# Altium project DIOT_tester.PrjPCB (part 1 of 3)
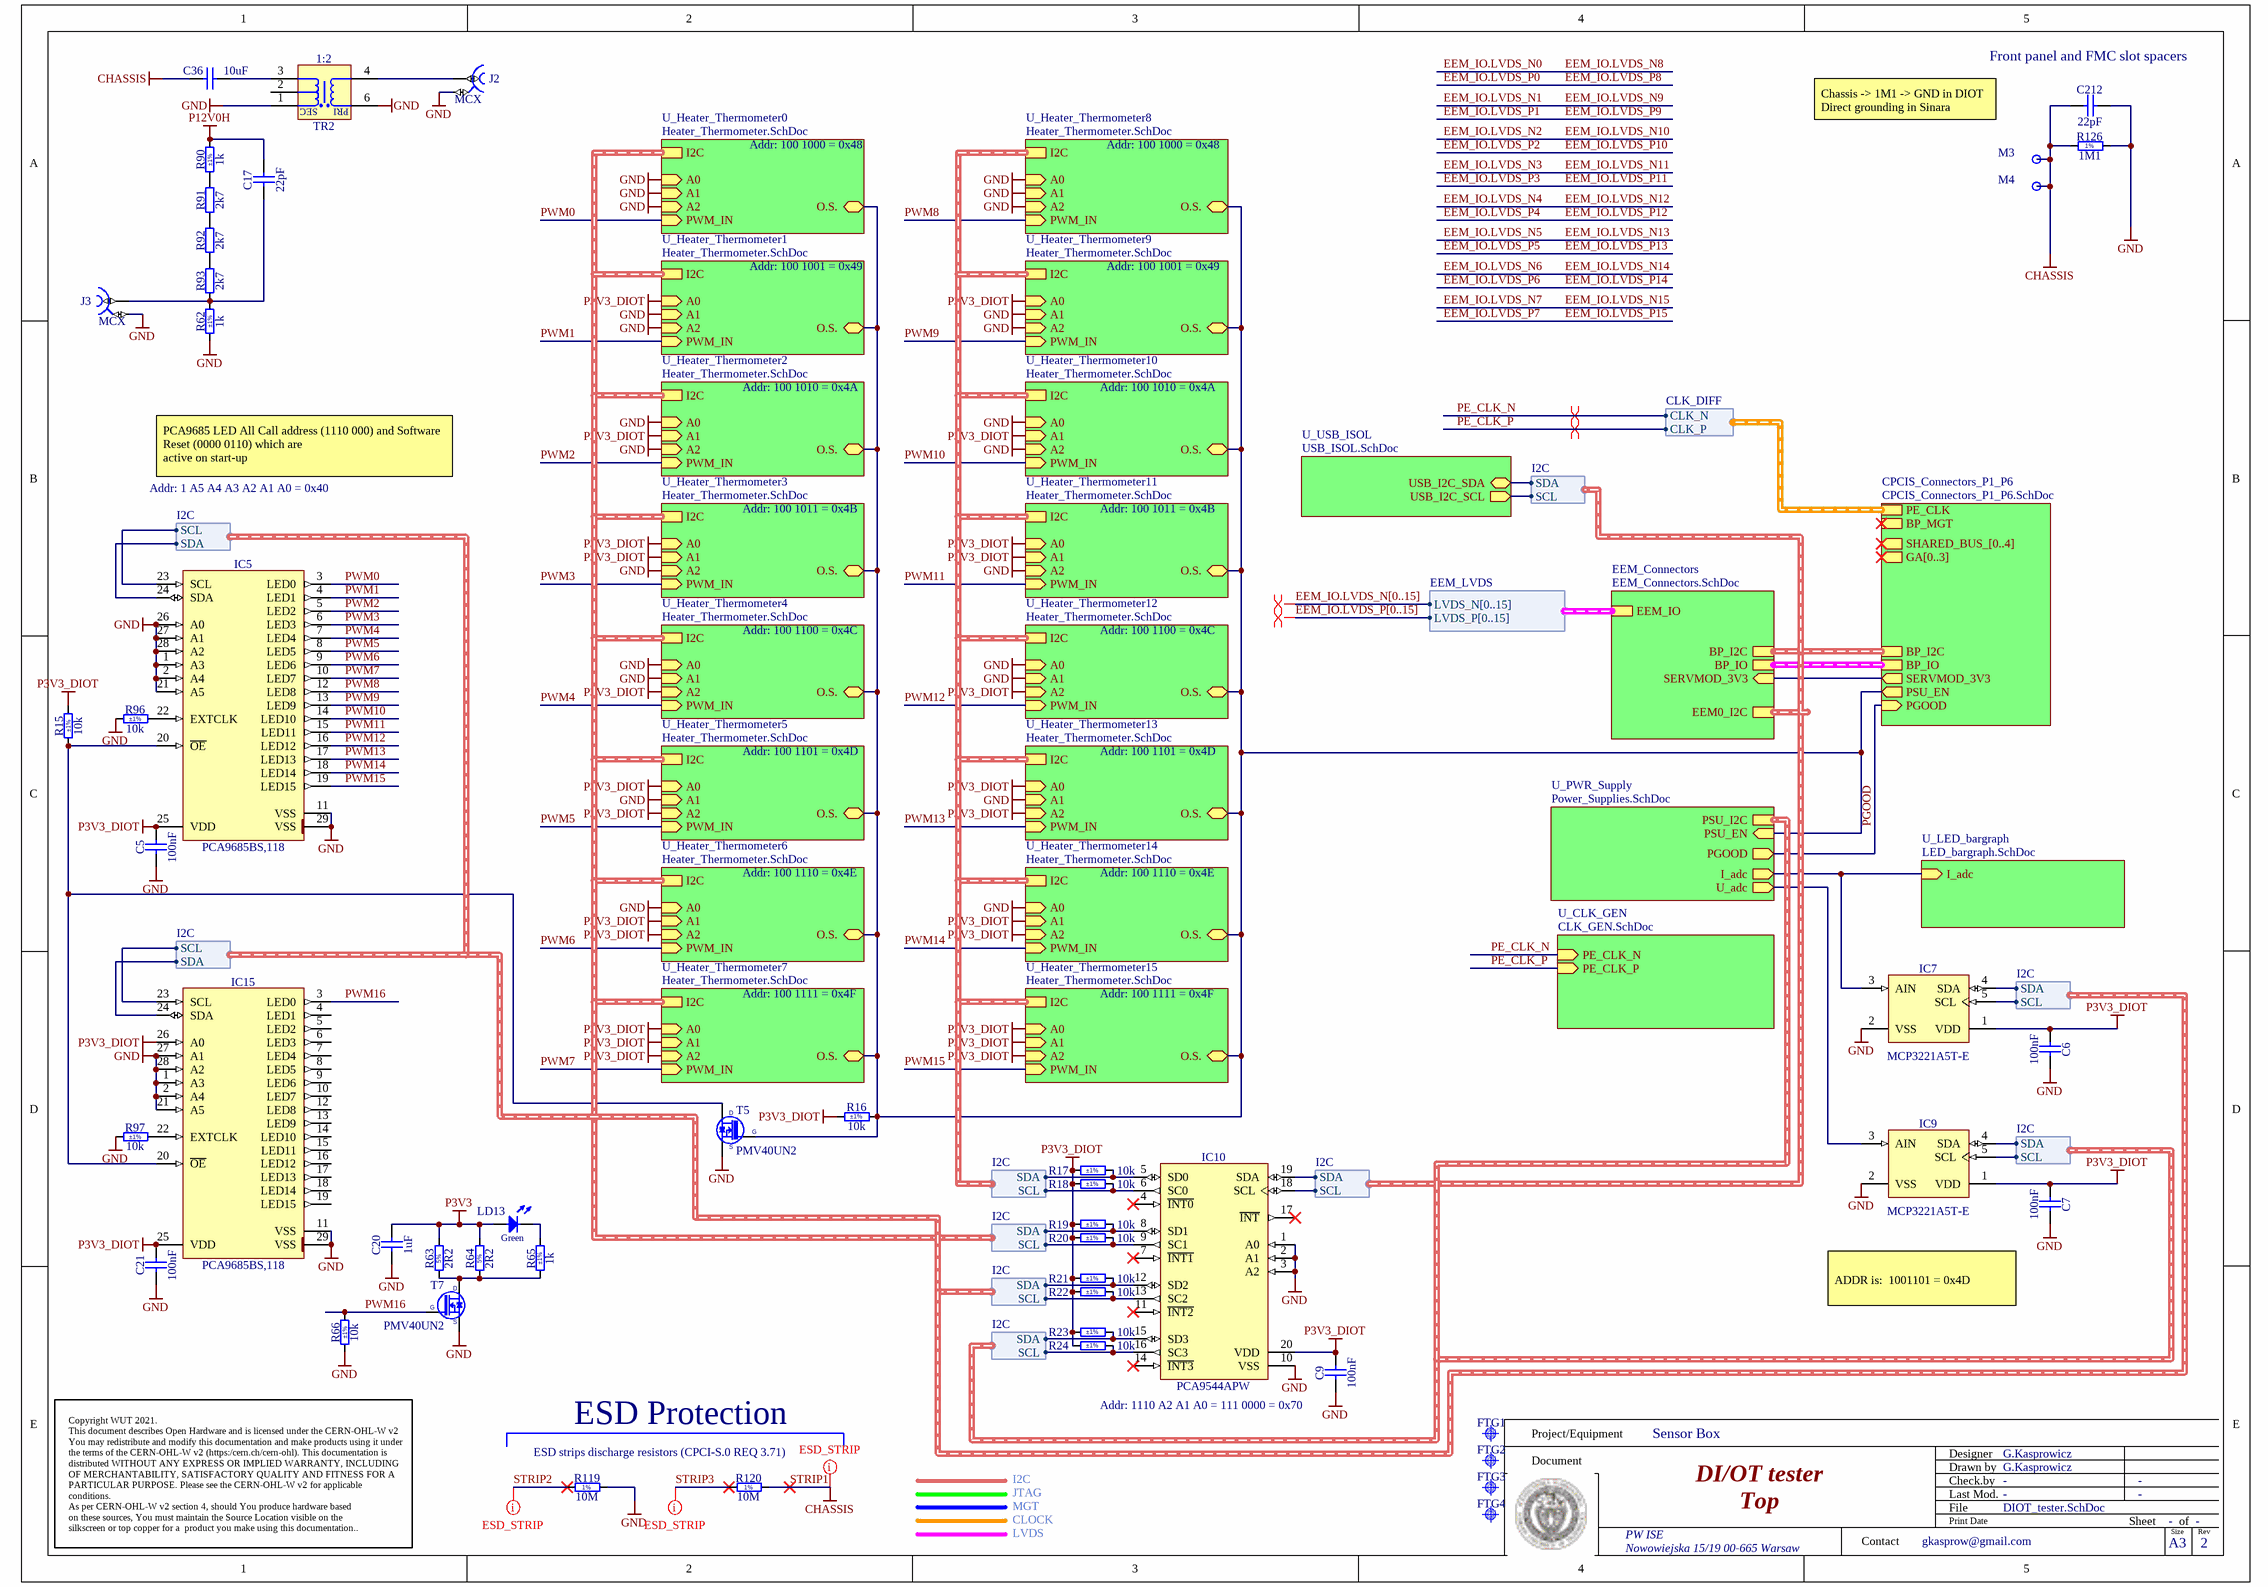
[diagram p0: DIOT_tester.SchDoc]
Address1: Warsaw University of Technology; Address2: Nowowiejska 15/19 00-665 Warsaw; Address3: Grzegorz.Kasprowicz@pw.edu.pl; CheckedBy: -; CheckedDate: -; Designer: Grzegorz Kasprowicz; DivGrp: ISE; DrawnBy: Grzegorz Kasprowicz; P_version: 1.1; Project1: 2CH_PM_Simulator; Projet: ARTIQ/Sinara; SheetTotal: 12; Title: 2CH_PM_Simulator; Version: 1.1
8 sheets, 432 parts. Net scope: hierarchical (ports join the sheet entries above them; power ports are global).
Board files: DIOT_tester.PcbDoc, Panel_DIOT_Tester.PcbDoc
Sheets:
  DIOT_tester.SchDoc
    U_PWR_Supply = Power_Supplies.SchDoc
    CPCIS_Connectors_P1_P6 = CPCIS_Connectors_P1_P6.SchDoc
    EEM_Connectors = EEM_Connectors.SchDoc
    U_CLK_GEN = CLK_GEN.SchDoc
    U_Heater_Thermometer0 = Heater_Thermometer.SchDoc
    U_Heater_Thermometer1 = Heater_Thermometer.SchDoc
    U_Heater_Thermometer2 = Heater_Thermometer.SchDoc
    U_Heater_Thermometer3 = Heater_Thermometer.SchDoc
    U_Heater_Thermometer4 = Heater_Thermometer.SchDoc
    U_Heater_Thermometer5 = Heater_Thermometer.SchDoc
    U_Heater_Thermometer6 = Heater_Thermometer.SchDoc
    U_Heater_Thermometer7 = Heater_Thermometer.SchDoc
    U_Heater_Thermometer8 = Heater_Thermometer.SchDoc
    U_Heater_Thermometer9 = Heater_Thermometer.SchDoc
    U_Heater_Thermometer10 = Heater_Thermometer.SchDoc
    U_Heater_Thermometer11 = Heater_Thermometer.SchDoc
    U_Heater_Thermometer12 = Heater_Thermometer.SchDoc
    U_Heater_Thermometer13 = Heater_Thermometer.SchDoc
    U_Heater_Thermometer14 = Heater_Thermometer.SchDoc
    U_Heater_Thermometer15 = Heater_Thermometer.SchDoc
    U_LED_bargraph = LED_bargraph.SchDoc
    U_USB_ISOL = USB_ISOL.SchDoc

## Sheet DIOT_tester.SchDoc: DI/OT tester
size 420 x 297 mm; EDA_Number: ARTIQ; Projet: ARTIQ/Sinara; Author: G.Kasprowicz; CompanyName: WUT ISE; DrawnBy: G.Kasprowicz; Organization: WUT ISE; Address1: PW ISE; Address2: Nowowiejska 15/19 00-665 Warsaw; Address3: gkasprow@gmail.com; Revision: 2; SheetNumber: -; SheetTotal: -; ModifiedBy: -; CheckedDate: -; Title2: Top; DivGrp: WUT ISE; Designer: G.Kasprowicz; ModifiedDate: -; ProjectName: Sensor Box

### Parts
C5  100nF  [CAPC1005X55N]
C6  100nF  [CAPC1005X55N]
C7  100nF  [CAPC1005X55N]
C9  100nF  [CAPC1005X55N]
C17  22pF  [CAPC1005X55N]
C20  1uF  [CAPC1608X87N]
C21  100nF  [CAPC1005X55N]
C36  10uF  [CAPC2012X95N]
C212  22pF  [CAPC1005X55N]
FTG1  Use only in PCB  [FIDUCIAL_TOP_C100-200]  (value not drawn)
FTG2  Use only in PCB  [FIDUCIAL_TOP_S100-200]  (value not drawn)
FTG3  Use only in PCB  [FIDUCIAL_TOP_S100-200]  (value not drawn)
FTG4  Use only in PCB  [FIDUCIAL_TOP_S100-200]  (value not drawn)
IC5  PCA9685BS,118  [QFN65P600X600X100-29N-S420]
IC7  MCP3221A5T-E  [SOT95P280X145-5N]
IC9  MCP3221A5T-E  [SOT95P280X145-5N]
IC10  PCA9544APW  [SOP65P640X110-20N]
IC15  PCA9685BS,118  [QFN65P600X600X100-29N-S420]
J2  MCX  [AMPHENOL_919-383J-51A]
J3  MCX  [AMPHENOL_919-383J-51A]
LD13  Green  [LED_KINGBRIGHT_KP-1608CGCK]
M3  Plated Hole  [MTG300_600]  (value not drawn)  (no BOM)
M4  Plated Hole  [MTG300_600]  (value not drawn)  (no BOM)
R15  10k  Tolerance: ±1%  [RESC1005X40N]
R16  10k  Tolerance: ±1%  [RESC1005X40N]
R17  10k  Tolerance: ±1%  [RESC1005X40N]
R18  10k  Tolerance: ±1%  [RESC1005X40N]
R19  10k  Tolerance: ±1%  [RESC1005X40N]
R20  10k  Tolerance: ±1%  [RESC1005X40N]
R21  10k  Tolerance: ±1%  [RESC1005X40N]
R22  10k  Tolerance: ±1%  [RESC1005X40N]
R23  10k  Tolerance: ±1%  [RESC1005X40N]
R24  10k  Tolerance: ±1%  [RESC1005X40N]
R62  1k  Tolerance: ±1%  [RESC1608X55N]
R63  2R2  [RESC6432X120N]
R64  2R2  [RESC6432X120N]
R65  1k  Tolerance: ±1%  [RESC1608X55N]
R66  10k  Tolerance: ±1%  [RESC1005X40N]
R90  1k  Tolerance: ±1%  [RESC1608X55N]
R91  2k7  [RESC1608X55N]
R92  2k7  [RESC1608X55N]
R93  2k7  [RESC1608X55N]
R96  10k  Tolerance: ±1%  [RESC1005X40N]
R97  10k  Tolerance: ±1%  [RESC1005X40N]
R119  10M  [RESC2113X55N]
R120  10M  [RESC2113X55N]
R126  1M1  [RESC2012X60N]
T5  PMV40UN2  [SOT95P230X110-3N]
T7  PMV40UN2  [SOT95P230X110-3N]
TR2  1:2  [XFMR_MINI-CIRCUITS_DB714]

### Sub-sheets
CPCIS_Connectors_P1_P6 = CPCIS_Connectors_P1_P6.SchDoc: BP_I2C (harness I2C), SERVMOD_3V3 (out), PSU_EN (out), PE_CLK (harness CLK_DIFF), BP_MGT (harness MGT), GA[0..3] (out), BP_IO (harness EEM_LVDS), SHARED_BUS_[0..4] (out), PGOOD (in)
EEM_Connectors = EEM_Connectors.SchDoc: EEM_IO (harness EEM_LVDS), BP_IO (harness EEM_LVDS), EEM0_I2C (harness I2C), BP_I2C (harness I2C), SERVMOD_3V3 (in)
U_CLK_GEN = CLK_GEN.SchDoc: PE_CLK_N (in), PE_CLK_P (in)
U_Heater_Thermometer0 = Heater_Thermometer.SchDoc: I2C (harness I2C), O.S. (bidir), A0 (in), A1 (in), A2 (in), PWM_IN (in)
U_Heater_Thermometer1 = Heater_Thermometer.SchDoc: I2C (harness I2C), O.S. (bidir), A0 (in), A1 (in), A2 (in), PWM_IN (in)
U_Heater_Thermometer2 = Heater_Thermometer.SchDoc: I2C (harness I2C), O.S. (bidir), A0 (in), A1 (in), A2 (in), PWM_IN (in)
U_Heater_Thermometer3 = Heater_Thermometer.SchDoc: I2C (harness I2C), O.S. (bidir), A0 (in), A1 (in), A2 (in), PWM_IN (in)
U_Heater_Thermometer4 = Heater_Thermometer.SchDoc: I2C (harness I2C), O.S. (bidir), A0 (in), A1 (in), A2 (in), PWM_IN (in)
U_Heater_Thermometer5 = Heater_Thermometer.SchDoc: I2C (harness I2C), O.S. (bidir), A0 (in), A1 (in), A2 (in), PWM_IN (in)
U_Heater_Thermometer6 = Heater_Thermometer.SchDoc: I2C (harness I2C), O.S. (bidir), A0 (in), A1 (in), A2 (in), PWM_IN (in)
U_Heater_Thermometer7 = Heater_Thermometer.SchDoc: I2C (harness I2C), O.S. (bidir), A0 (in), A1 (in), A2 (in), PWM_IN (in)
U_Heater_Thermometer8 = Heater_Thermometer.SchDoc: I2C (harness I2C), O.S. (bidir), A0 (in), A1 (in), A2 (in), PWM_IN (in)
U_Heater_Thermometer9 = Heater_Thermometer.SchDoc: I2C (harness I2C), O.S. (bidir), A0 (in), A1 (in), A2 (in), PWM_IN (in)
U_Heater_Thermometer10 = Heater_Thermometer.SchDoc: I2C (harness I2C), O.S. (bidir), A0 (in), A1 (in), A2 (in), PWM_IN (in)
U_Heater_Thermometer11 = Heater_Thermometer.SchDoc: I2C (harness I2C), O.S. (bidir), A0 (in), A1 (in), A2 (in), PWM_IN (in)
U_Heater_Thermometer12 = Heater_Thermometer.SchDoc: I2C (harness I2C), O.S. (bidir), A0 (in), A1 (in), A2 (in), PWM_IN (in)
U_Heater_Thermometer13 = Heater_Thermometer.SchDoc: I2C (harness I2C), O.S. (bidir), A0 (in), A1 (in), A2 (in), PWM_IN (in)
U_Heater_Thermometer14 = Heater_Thermometer.SchDoc: I2C (harness I2C), O.S. (bidir), A0 (in), A1 (in), A2 (in), PWM_IN (in)
U_Heater_Thermometer15 = Heater_Thermometer.SchDoc: I2C (harness I2C), O.S. (bidir), A0 (in), A1 (in), A2 (in), PWM_IN (in)
U_LED_bargraph = LED_bargraph.SchDoc: I_adc (in)
U_PWR_Supply = Power_Supplies.SchDoc: PSU_EN (in), PSU_I2C (harness I2C), PGOOD (out), I_adc (out), U_adc (out)
U_USB_ISOL = USB_ISOL.SchDoc: USB_I2C_SDA (bidir), USB_I2C_SCL (out)

### Harnesses
EEM_LVDS: LVDS_P[0..15], LVDS_N[0..15]
CLK_DIFF: CLK_N, CLK_P
I2C: SDA, SCL

### Nets
GND: C5.1 C6.1 C7.1 C9.1 C20.1 C21.1 C212.2 IC5.1(A3) IC5.2(A4) IC5.11(VSS) IC5.21(A5) IC5.26(A0) IC5.27(A1) IC5.28(A2) IC5.29(VSS) IC7.2(VSS) IC9.2(VSS) IC10.1(A0) IC10.2(A1) IC10.3(A2) IC10.10(VSS) IC15.1(A3) IC15.2(A4) IC15.11(VSS) IC15.21(A5) IC15.27(A1) IC15.28(A2) IC15.29(VSS) J2.2 J3.2 R62.1 R66.1 R96.1 R97.1 R119.2 R126.2 T5.2(S) T7.2(S) TR2.1(SDOT) TR2.6(PDOT) ; sheet U_Heater_Thermometer0/A0, sheet U_Heater_Thermometer0/A1, sheet U_Heater_Thermometer0/A2, sheet U_Heater_Thermometer1/A1, sheet U_Heater_Thermometer1/A2, sheet U_Heater_Thermometer2/A0, sheet U_Heater_Thermometer2/A2, sheet U_Heater_Thermometer3/A2, sheet U_Heater_Thermometer4/A0, sheet U_Heater_Thermometer4/A1, sheet U_Heater_Thermometer5/A1, sheet U_Heater_Thermometer6/A0, sheet U_Heater_Thermometer8/A0, sheet U_Heater_Thermometer8/A1, sheet U_Heater_Thermometer8/A2, sheet U_Heater_Thermometer9/A1, sheet U_Heater_Thermometer9/A2, sheet U_Heater_Thermometer10/A0, sheet U_Heater_Thermometer10/A2, sheet U_Heater_Thermometer11/A2, sheet U_Heater_Thermometer12/A0, sheet U_Heater_Thermometer12/A1, sheet U_Heater_Thermometer13/A1, sheet U_Heater_Thermometer14/A0
P3V3: C20.2 LD13.2(A) R63.2 R64.2
P3V3_DIOT: C5.2 C6.2 C7.2 C9.2 C21.2 IC5.25(VDD) IC7.1(VDD) IC9.1(VDD) IC10.20(VDD) IC15.25(VDD) IC15.26(A0) R15.2 R16.1 R17.1 R18.1 R19.1 R20.1 R21.1 R22.1 R23.1 R24.1 ; sheet U_Heater_Thermometer1/A0, sheet U_Heater_Thermometer2/A1, sheet U_Heater_Thermometer3/A0, sheet U_Heater_Thermometer3/A1, sheet U_Heater_Thermometer4/A2, sheet U_Heater_Thermometer5/A0, sheet U_Heater_Thermometer5/A2, sheet U_Heater_Thermometer6/A1, sheet U_Heater_Thermometer6/A2, sheet U_Heater_Thermometer7/A0, sheet U_Heater_Thermometer7/A1, sheet U_Heater_Thermometer7/A2, sheet U_Heater_Thermometer9/A0, sheet U_Heater_Thermometer10/A1, sheet U_Heater_Thermometer11/A0, sheet U_Heater_Thermometer11/A1, sheet U_Heater_Thermometer12/A2, sheet U_Heater_Thermometer13/A0, sheet U_Heater_Thermometer13/A2, sheet U_Heater_Thermometer14/A1, sheet U_Heater_Thermometer14/A2, sheet U_Heater_Thermometer15/A0, sheet U_Heater_Thermometer15/A1, sheet U_Heater_Thermometer15/A2
P12V0H: C17.2 R90.2
STRIP1: C36.2 C212.1 M3.1 M4.1 R120.2 R126.1  [also labelled CHASSIS]
EEM0_I2C.SCL: IC10.18(SCL) ; sheet U_USB_ISOL/USB_I2C_SCL, sheet EEM_Connectors/EEM0_I2C.SCL
EEM0_I2C.SDA: IC10.19(SDA) ; sheet U_USB_ISOL/USB_I2C_SDA, sheet EEM_Connectors/EEM0_I2C.SDA
i_adc: IC7.3(AIN) ; sheet U_PWR_Supply/I_adc, sheet U_LED_bargraph/I_adc
PE_CLK_N: sheet U_CLK_GEN/PE_CLK_N, sheet CPCIS_Connectors_P1_P6/PE_CLK.CLK_N  [project net PE_CLK.CLK_N]
PE_CLK_P: sheet U_CLK_GEN/PE_CLK_P, sheet CPCIS_Connectors_P1_P6/PE_CLK.CLK_P  [project net PE_CLK.CLK_P]
PGOOD: sheet U_PWR_Supply/PGOOD, sheet CPCIS_Connectors_P1_P6/PGOOD
PSU_EN: R16.2 T5.1(G) ; sheet U_PWR_Supply/PSU_EN, sheet CPCIS_Connectors_P1_P6/PSU_EN, sheet U_Heater_Thermometer0/O.S., sheet U_Heater_Thermometer1/O.S., sheet U_Heater_Thermometer2/O.S., sheet U_Heater_Thermometer3/O.S., sheet U_Heater_Thermometer4/O.S., sheet U_Heater_Thermometer5/O.S., sheet U_Heater_Thermometer6/O.S., sheet U_Heater_Thermometer7/O.S., sheet U_Heater_Thermometer8/O.S., sheet U_Heater_Thermometer9/O.S., sheet U_Heater_Thermometer10/O.S., sheet U_Heater_Thermometer11/O.S., sheet U_Heater_Thermometer12/O.S., sheet U_Heater_Thermometer13/O.S., sheet U_Heater_Thermometer14/O.S., sheet U_Heater_Thermometer15/O.S.
PWM0: IC5.3(LED0) ; sheet U_Heater_Thermometer0/PWM_IN
PWM1: IC5.4(LED1) ; sheet U_Heater_Thermometer1/PWM_IN
PWM2: IC5.5(LED2) ; sheet U_Heater_Thermometer2/PWM_IN
PWM3: IC5.6(LED3) ; sheet U_Heater_Thermometer3/PWM_IN
PWM4: IC5.7(LED4) ; sheet U_Heater_Thermometer4/PWM_IN
PWM5: IC5.8(LED5) ; sheet U_Heater_Thermometer5/PWM_IN
PWM6: IC5.9(LED6) ; sheet U_Heater_Thermometer6/PWM_IN
PWM7: IC5.10(LED7) ; sheet U_Heater_Thermometer7/PWM_IN
PWM8: IC5.12(LED8) ; sheet U_Heater_Thermometer8/PWM_IN
PWM9: IC5.13(LED9) ; sheet U_Heater_Thermometer9/PWM_IN
PWM10: IC5.14(LED10) ; sheet U_Heater_Thermometer10/PWM_IN
PWM11: IC5.15(LED11) ; sheet U_Heater_Thermometer11/PWM_IN
PWM12: IC5.16(LED12) ; sheet U_Heater_Thermometer12/PWM_IN
PWM13: IC5.17(LED13) ; sheet U_Heater_Thermometer13/PWM_IN
PWM14: IC5.18(LED14) ; sheet U_Heater_Thermometer14/PWM_IN
PWM15: IC5.19(LED15) ; sheet U_Heater_Thermometer15/PWM_IN
PWM16: IC15.3(LED0) R66.2 T7.1(G)
SERVMOD_3V3: sheet CPCIS_Connectors_P1_P6/SERVMOD_3V3, sheet EEM_Connectors/SERVMOD_3V3
STRIP2: R119.1
STRIP3: R120.1
NetC2_2: IC9.3(AIN) ; sheet U_PWR_Supply/U_adc
NetC17_1: C17.1 J3.1 R62.2 R93.1
NetC36_1: C36.1 TR2.3(S)
NetIC5_20: IC5.20(~{OE}) IC15.20(~{OE}) R15.1 T5.3(D)
NetIC5_22: IC5.22(EXTCLK) R96.2
NetIC5_23: IC5.23(SCL) IC7.5(SCL) IC10.13(SC2) IC15.23(SCL) R22.2 ; harness I2C.SCL
NetIC5_24: IC5.24(SDA) IC7.4(SDA) IC10.12(SD2) IC15.24(SDA) R21.2 ; harness I2C.SDA
NetIC9_4: IC9.4(SDA) IC10.15(SD3) R23.2 ; sheet U_PWR_Supply/PSU_I2C.SDA
NetIC9_5: IC9.5(SCL) IC10.16(SC3) R24.2 ; sheet U_PWR_Supply/PSU_I2C.SCL
NetIC10_5: IC10.5(SD0) R17.2 ; sheet U_Heater_Thermometer8/I2C.SDA
NetIC10_6: IC10.6(SC0) R18.2 ; sheet U_Heater_Thermometer8/I2C.SCL
NetIC10_8: IC10.8(SD1) R19.2 ; sheet U_Heater_Thermometer0/I2C.SDA
NetIC10_9: IC10.9(SC1) R20.2 ; sheet U_Heater_Thermometer0/I2C.SCL
NetIC15_22: IC15.22(EXTCLK) R97.2
NetJ2_1: J2.1 TR2.4(P)
NetLD13_1: LD13.1(C) R65.2
NetR63_1: R63.1 R64.1 R65.1 T7.3(D)
NetR90_1: R90.1 R91.2
NetR91_1: R91.1 R92.2
NetR92_1: R92.1 R93.2

Not connected (* = marked no-connect by the designer): IC10 4(~{INT0})* 7(~{INT1})* 11(~{INT2})* 14(~{INT3})* 17(~{INT})*; IC15 4(LED1) 5(LED2) 6(LED3) 7(LED4) 8(LED5) 9(LED6) 10(LED7) 12(LED8) 13(LED9) 14(LED10) 15(LED11) 16(LED12) 17(LED13) 18(LED14) 19(LED15); TR2 2(NU)

### Buses and harness runs
bus EEM_IO.LVDS_N[0..15]
bus EEM_IO.LVDS_P[0..15]
harness sheet CPCIS_Connectors_P1_P6/BP_I2C = sheet EEM_Connectors/BP_I2C
harness sheet CPCIS_Connectors_P1_P6/BP_IO = sheet EEM_Connectors/BP_IO
harness sheet U_Heater_Thermometer0/I2C = sheet U_Heater_Thermometer1/I2C = sheet U_Heater_Thermometer2/I2C = sheet U_Heater_Thermometer3/I2C = sheet U_Heater_Thermometer4/I2C = sheet U_Heater_Thermometer5/I2C = sheet U_Heater_Thermometer6/I2C = sheet U_Heater_Thermometer7/I2C
harness sheet U_Heater_Thermometer8/I2C = sheet U_Heater_Thermometer9/I2C = sheet U_Heater_Thermometer10/I2C = sheet U_Heater_Thermometer11/I2C = sheet U_Heater_Thermometer12/I2C = sheet U_Heater_Thermometer13/I2C = sheet U_Heater_Thermometer14/I2C = sheet U_Heater_Thermometer15/I2C

### Layout directives
net class ESD_STRIP: STRIP1, STRIP2, STRIP3
differential pair; differential pair class Diff_100Ohm: (no net found under the mark), PE_CLK.CLK_N, PE_CLK.CLK_P

### Notes on the sheet
- Chassis -> 1M1 -> GND in DIOT
  Direct grounding in Sinara
- (near C212) Front panel and FMC slot spacers
- Addr: 100 1000 = 0x48
- Addr: 100 1001 = 0x49
- Addr: 100 1010 = 0x4A
- Addr: 1 A5 A4 A3 A2 A1 A0 = 0x40
- PCA9685 LED All Call address (1110 000) and Software Reset (0000 0110) which are
  active on start-up
- Addr: 100 1011 = 0x4B
- Addr: 100 1100 = 0x4C
- Addr: 100 1101 = 0x4D
- Addr: 100 1110 = 0x4E
- Addr: 100 1111 = 0x4F
- ADDR is:  1001101 = 0x4D
- ESD strips discharge resistors (CPCI-S.0 REQ 3.71)
- ESD Protection
- Addr: 1110 A2 A1 A0 = 111 0000 = 0x70
- I2C
- JTAG
- MGT
- CLOCK
- LVDS
- Project/Equipment
- Document
- Designer
- Drawn by
- Check.by
- Contact
- File
- Last Mod.
- Print Date
- Sheet
- Size
- A3
- of
- Rev
- Copyright WUT 2021.
  This document describes Open Hardware and is licensed under the CERN-OHL-W v2
  You may redistribute and modify this documentation and make products using it under the terms of the CERN-OHL-W v2 (https:/cern.ch/cern-ohl). This documentation is distributed WITHOUT ANY EXPRESS OR IMPLIED WARRANTY, INCLUDING OF MERCHANTABILITY, SATISFACTORY QUALITY AND FITNESS FOR A PARTICULAR PURPOSE. Please see the CERN-OHL-W v2 for applicable conditions.
  As per CERN-OHL-W v2 section 4, should You produce hardware based
  on these sources, You must maintain the Source Location visible on the
  silkscreen or top copper for a  product you make using this documentation..
- (in symbol R0805_1M1_1%_0.125W_100PPM) 1%
- (in symbol R0805_10M_1%_0.125W_100PPM_VISHAY_CRCW e3) 1%
- (in symbol R2512_2R2_5%_3W_100PPM_TYCO_3522) 5%
- (in symbol XFMR_MINI-CIRCUITS_TCM2-1T) SEC; PRI

### Library data of the parts
C5-C7 C9 C21 = CC0402_100NF_50V_10%_X7R: Non-polarised capacitor; Part Description: SMD Multilayer Chip Ceramic Capacitor; Manufacturer: GENERIC; Manufacturer1 Part Number: GRM155R71H104KE14D; Voltage: 50V; TC: X7R; Tolerance: ±10%; Part Number: CC0402_100NF_50V_10%_X7R; Component Kind: Standard; Component Type: Standard; Pin Count: 2; Value: 100nF; Status: None; Manufacturer Part Number: CC0402_100NF_50V_10%_X7R; Case: 0402; Mounted: Yes; Socket: No; SMD: Yes; Sense: No; Manufacturer1 Example: MURATA; Manufacturer1 ComponentHeight: 0.55mm; HelpURL: \\cern.ch\dfs\Applications\Altium\Datasheets\CC0402_MURATA_GRM155R71H104KE14D.pdf; Author: CERN DEM MR; CreateDate: 30.06.2017; LatestRevisionDate: 30.06.2017
C17 C212 = CC0402_22PF_50V_5%_C0G: Non-polarised capacitor; Part Description: SMD Multilayer Chip Ceramic Capacitor; Manufacturer: GENERIC; Manufacturer1 Part Number: C0402C220J5GACTU; Voltage: 50V; TC: C0G/NP0; Tolerance: ±5%; Part Number: CC0402_22PF_50V_5%_C0G; Component Kind: Standard; Component Type: Standard; Pin Count: 2; Value: 22pF; Status: Preferred; Manufacturer Part Number: CC0402_22PF_50V_5%_C0G; Case: 0402; Mounted: Yes; Socket: No; SMD: Yes; Sense: No; Manufacturer1 Example: KEMET; Manufacturer1 ComponentHeight: 0.55mm; Author: CERN DEM JLC
  C17: HelpURL: \\cern.ch\dfs\Applications\Altium\Datasheets\CC0805_C0G_KEMET_(Commercial Grade).pdf; CreateDate: 03.12.2007; LatestRevisionDate: 03.12.2007
  C212: HelpURL: \\cern.ch\dfs\Applications\Altium\Datasheets\CC0402_C0G_KEMET_(Commercial Grade).pdf; CreateDate: 2007-12-03; LatestRevisionDate: 2007-12-03
C20 = CC0603_1UF_25V_10%_X7R: Non-polarised capacitor; Part Description: SMD Multilayer Chip Ceramic Capacitor; Manufacturer: GENERIC; Manufacturer1 Part Number: GRM188R71E105KA12D; Voltage: 25V; TC: X7R; Tolerance: ±10%; Part Number: CC0603_1UF_25V_10%_X7R; Component Kind: Standard; Component Type: Standard; Pin Count: 2; Value: 1uF; Status: None; Manufacturer Part Number: CC0603_1UF_25V_10%_X7R; Case: 0603; Mounted: Yes; Socket: No; SMD: Yes; Sense: No; Manufacturer1 Example: MURATA; Manufacturer1 ComponentHeight: 0.9mm; HelpURL: \\cern.ch\dfs\Applications\Altium\Datasheets\CC0603_X7R_MURATA.pdf; Author: CERN DEM JLC; CreateDate: 18.01.2011; LatestRevisionDate: 18.01.2011
C36 = CC0805_10UF_25V_10%_X5R: Non-polarised capacitor; Part Description: SMD Multilayer Chip Ceramic Capacitor; Manufacturer: GENERIC; Manufacturer1 Part Number: GRM219R61E106KA12D; Voltage: 25V; TC: X5R; Tolerance: ±10%; Part Number: CC0805_10UF_25V_10%_X5R; Component Kind: Standard; Component Type: Standard; Pin Count: 2; Value: 10uF; Status: Preferred; Manufacturer Part Number: CC0805_10UF_25V_10%_X5R; Case: 0805; Mounted: Yes; Socket: No; SMD: Yes; Sense: No; Manufacturer1 Example: MURATA; Manufacturer1 ComponentHeight: 0.95mm; HelpURL: \\cern.ch\dfs\Applications\Altium\Datasheets\CC0805_X5R_MURATA_GRM.pdf; Author: CERN DEM JLC; CreateDate: 25.10.2012; LatestRevisionDate: 06.09.2016
FTG1 = FIDUCIAL_TARGET_C100-200: Fiducial Target; Part Description: Round Fiducial Target, Top Layer, 1.0mm, Top Solder 2.0mm, Keepout =2.0mm; Mounted: No; Part Number: FIDUCIAL_TARGET_C100-200; Component Kind: Standard (No BOM); Component Type: Standard (No BOM); Pin Count: 1; Family: Fiducial; Socket: No; SMD: Yes; Sense: No; Status: None; ComponentHeight: 0mm; HelpURL: Undefined; Author: CERN DEM JLC; CreateDate: 09.02.2010; LatestRevisionDate: 04.04.2012; PackageDescription: Round Fiducial Target, Top Layer, 1.0mm, Top Solder 2.0mm, Keepout =2.0mm
FTG2-FTG4 = FIDUCIAL_TARGET_S100-200: Fiducial Target; Part Description: Square Fiducial Target, Top Layer, 1.0mm, Top Solder 2.0mm, Keepout =2.0mm; Mounted: No; Part Number: FIDUCIAL_TARGET_S100-200; Component Kind: Standard (No BOM); Component Type: Standard (No BOM); Pin Count: 1; Family: Fiducial; Socket: No; SMD: Yes; Sense: No; Status: None; ComponentHeight: 0mm; HelpURL: Undefined; Author: CERN DEM JLC; CreateDate: 09.02.2010; LatestRevisionDate: 04.04.2012; PackageDescription: Square Fiducial Target, Top Layer, 1.0mm, Top Solder 2.0mm, Keepout =2.0mm
IC5 IC15 = PCA9685BS,118: 16-Channel, 12-Bit PWM Fm+ I2C-Bus LED Controller; Manufacturer: NXP SEMICONDUCTORS; PressFit: No; Bonding: No; Part Number: PCA9685BS,118; Component Kind: Standard; Component Type: Standard; Device: PCA9685BS,118; PackageDescription: QFN, 0.65mm Pitch, Square; 28 Pin, 6.00mm L X 6.00mm W X 1.00mm H Body (w/Thermal Tab 4.2mm x 4.2mm), IPC Medium Density; Part Description: 16-Channel, 12-Bit PWM Fm+ I2C-Bus LED Controller; Manufacturer Part Number: PCA9685BS,118; Pin Count: 29; Case: QFN28; Mounted: Yes; Socket: No; SMD: Yes; Sense: No; ComponentHeight: 1mm; Author: CERN DEM HF; HelpURL: \\cern.ch\dfs\Applications\Altium\Datasheets\PCA9685BS,118.pdf; CreateDate: 05.11.2021; LatestRevisionDate: 05.11.2021
IC7 IC9 = MCP3221A5T-E: Low-Power 12-Bit A/D Converter with I2C Interface; Part Description: Low-Power 12-Bit A/D Converter with I2C Interface, A5 Address; Manufacturer: MICROCHIP TECHNOLOGY; PressFit: No; Bonding: No; Part Number: MCP3221A5T-E; Component Kind: Standard; Component Type: Standard; Device: MCP3221A5T-E; PackageDescription: SOT, 0.95mm Pitch; 5 Pin, 1.60mm W X 2.90mm L X 1.45mm H body, IPC Medium Density; Manufacturer Part Number: MCP3221A5T-E; Pin Count: 5; Case: SOT23-5; Mounted: Yes; Socket: No; SMD: Yes; Sense: No; ComponentHeight: 1.45mm; Author: CERN DEM HF; HelpURL: \\cern.ch\dfs\Applications\Altium\Datasheets\MCP3221AXT-E.pdf; CreateDate: 06.12.2023; LatestRevisionDate: 06.12.2023
IC10 = PCA9544APW: 4-Channel I2C-Bus Multiplexer with Interrupt Logic; Manufacturer: NXP SEMICONDUCTORS; PressFit: No; Bonding: No; Part Number: PCA9544APW; Component Kind: Standard; Component Type: Standard; Device: PCA9544APW; PackageDescription: SOP, 0.65mm Pitch; 20 Pin, 4.40mm W X 6.50mm L X 1.10mm H body, IPC Medium Density; Part Description: 4-Channel I2C-Bus Multiplexer with Interrupt Logic; Manufacturer Part Number: PCA9544APW; Pin Count: 20; Case: TSSOP20; Mounted: Yes; Socket: No; SMD: Yes; Sense: No; ComponentHeight: 1.1mm; Author: CERN DEM JLC; HelpURL: \\cern.ch\dfs\Applications\Altium\Datasheets\PCA9544APW.pdf; CreateDate: 06.10.2014; LatestRevisionDate: 06.10.2014
J2 J3 = AMPHENOL_919-383J-51A: Part Description: 50 Ohms, RF Connector, MCX Right Angle PCB Receptacle Jack; PressFit: No; Part Number: AMPHENOL_919-383J-51A; Component Kind: Standard; Component Type: Standard; Pin Count: 5; Family: MCX; Mounted: Yes; Socket: No; SMD: No; Sense: No; Status: None; Manufacturer: AMPHENOL; Manufacturer Part Number: 919-383J-51A; ComponentHeight: 6mm; HelpURL: \\cern.ch\dfs\Applications\Altium\Datasheets\AMPHENOL_919-383J-51A.pdf; Author: CERN DEM BC; CreateDate: 31.01.2019; LatestRevisionDate: 31.01.2019
LD13 = LED_KINGBRIGHT_KP-1608CGCK: LED Green 1C 2A; Part Description: 1.6x0.8mm SMD Chip Green LED Lamp; PressFit: No; Bonding: No; Part Number: LED_KINGBRIGHT_KP-1608CGCK; Component Kind: Standard; Component Type: Standard; Color: Green; PackageDescription: SMT Green LED, Case 0603, Body L 1.60mm x W 0.80mm x H 1.10mm; Manufacturer: KINGBRIGHT; Manufacturer Part Number: KP-1608CGCK; Pin Count: 2; Case: 0603; Mounted: Yes; Socket: No; SMD: Yes; Sense: No; ComponentHeight: 1.1mm; HelpURL: \\cern.ch\dfs\Applications\Altium\Datasheets\LED_KINGBRIGHT_KP-1608CGCK.pdf; Author: CERN DEM HF; CreateDate: 01.10.2021; LatestRevisionDate: 01.10.2021
M3 M4 = PLATED_HOLE3.0_PAD6.0: Single Terminal Socket; Part Description: Plated Through Hole: Hole Dia.=3.0mm Pad Dia.=6.0mm; Mounted: No; Table: Pads; Part Number: PLATED_HOLE3.0_PAD6.0; Component Type: Standard (No BOM); Designator: Single Terminal Socket; Library Reference: Single Terminal Socket; Pin Count: 1; Family: Plated Hole; Socket: No; SMD: No; Status: None; ComponentHeight: 0mm; Author: CERN DEM JLC; CreateDate: 26.05.2008; LatestRevisionDate: 26.05.2008; PackageDescription: Plated Through Hole: Hole Dia.=3.0mm Pad Dia.=6.0mm
R15-R24 R66 R96 R97 = R0402_10K_1%_0.0625W_100PPM: Resistor - 1%; Part Description: General Purpose Thick Film Chip Resistor; Manufacturer: GENERIC; Manufacturer1 Part Number: 232270671003L; TC: ±100ppm/°C; PressFit: No; Part Number: R0402_10K_1%_0.0625W_100PPM; Component Kind: Standard; Component Type: Standard; Pin Count: 2; Value: 10k; Status: Not Recommended; Power: 0.0625W; Manufacturer Part Number: R0402_10K_1%_0.0625W_100PPM; Case: 0402; Mounted: Yes; Sense: No; Socket: No; SMD: Yes; Manufacturer1 Example: YAGEO PHYCOMP; Manufacturer1 ComponentHeight: 0.4mm; HelpURL: \\cern.ch\dfs\Applications\Altium\Datasheets\R0402_Phycomp_RC0402.pdf; Author: CERN DEM JLC; CreateDate: 03.12.2007; LatestRevisionDate: 17.10.2012
R62 R65 R90 = R0603_1K_1%_0.1W_100PPM: Resistor - 1%; Part Description: General Purpose Thick Film Chip Resistor; Manufacturer: GENERIC; Manufacturer1 Part Number: NRC06F1001TRF; Power: 0.1W; TC: ±100ppm/°C; PressFit: No; Part Number: R0603_1K_1%_0.1W_100PPM; Component Kind: Standard; Component Type: Standard; Pin Count: 2; Value: 1k; Status: Preferred; Manufacturer Part Number: R0603_1K_1%_0.1W_100PPM; Case: 0603; Mounted: Yes; Sense: No; Socket: No; SMD: Yes; Manufacturer1 Example: NIC COMPONENT; Manufacturer1 ComponentHeight: 0.55mm; HelpURL: \\cern.ch\dfs\Applications\Altium\Datasheets\R0603_NIC_NRC.pdf; Author: CERN DEM JLC; CreateDate: 03.12.2007; LatestRevisionDate: 13.03.2008
R63 R64 = R2512_2R2_5%_3W_100PPM_TYCO_3522: Resistor - 5%; Part Description: SMD Power Resistor; Manufacturer: TYCO; Manufacturer Part Number: 2176230-6 (35222R2JT); Power: 3W; TC: ±100ppm/°C; PressFit: No; Part Number: R2512_2R2_5%_3W_100PPM_TYCO_3522; Component Kind: Standard; Component Type: Standard; Pin Count: 2; Value: 2R2; Status: None; Tolerance: ±5%; Case: 2512; Mounted: Yes; Sense: No; Socket: No; SMD: Yes; ComponentHeight: 1.2mm; HelpURL: \\cern.ch\dfs\Applications\Altium\Datasheets\R2512_TYCO_3522.pdf; Author: CERN DEM MR; CreateDate: 09.01.2018; LatestRevisionDate: 09.01.2018
R91-R93 = R0603_2K7_1%_0.1W_100PPM: Resistor - 1%; Part Description: General Purpose Thick Film Chip Resistor; Manufacturer: GENERIC; Manufacturer1 Part Number: RC0603FR-072K7L; Power: 0.1W; TC: ±100ppm/°C; PressFit: No; Part Number: R0603_2K7_1%_0.1W_100PPM; Component Kind: Standard; Component Type: Standard; Pin Count: 2; Value: 2k7; Status: Preferred; Tolerance: ±1%; Manufacturer Part Number: R0603_2K7_1%_0.1W_100PPM; Case: 0603; Mounted: Yes; Sense: No; Socket: No; SMD: Yes; Manufacturer1 Example: YAGEO PHYCOMP; Manufacturer1 ComponentHeight: 0.55mm; HelpURL: \\cern.ch\dfs\Applications\Altium\Datasheets\R0603_PHYCOMP_RC0603.pdf; Author: CERN DEM JLC; CreateDate: 02.05.2011; LatestRevisionDate: 02.05.2011
R119 R120 = R0805_10M_1%_0.125W_100PPM_VISHAY_CRCW e3: Resistor - 1%; Part Description: 150V, Standard Thick Film Chip Resistor; Manufacturer: VISHAY DALE; Manufacturer Part Number: CRCW080510M0FKEA; Power: 0.125W; TC: ±100ppm/°C; PressFit: No; Part Number: R0805_10M_1%_0.125W_100PPM_VISHAY_CRCW e3; Component Kind: Standard; Component Type: Standard; Pin Count: 2; Value: 10M; Status: None; Tolerance: ±1%; Case: 0805; Mounted: Yes; Sense: No; Socket: No; SMD: Yes; ComponentHeight: 0.5mm; HelpURL: \\cern.ch\dfs\Applications\Altium\Datasheets\R0805_VISHAY_CRCW e3.pdf; Author: CERN DEM BC; CreateDate: 2019-11-12; LatestRevisionDate: 2019-11-12
R126 = R0805_1M1_1%_0.125W_100PPM: Resistor - 1%; Part Description: General Purpose Thick Film Chip Resistor; Manufacturer: GENERIC; Manufacturer1 Part Number: NRC10F1104TRF; PressFit: No; Part Number: R0805_1M1_1%_0.125W_100PPM; Component Kind: Standard; Component Type: Standard; Pin Count: 2; Value: 1M1; Status: Preferred; Manufacturer Part Number: R0805_1M1_1%_0.125W_100PPM; Case: 0805; Mounted: Yes; Sense: No; Socket: No; SMD: Yes; Manufacturer1 Example: NIC COMPONENT; Manufacturer1 ComponentHeight: 0.6mm; HelpURL: \\cern.ch\dfs\Applications\Altium\Datasheets\R0805_NIC_NRC.pdf; Author: CERN DEM JLC; CreateDate: 03/12/2007; LatestRevisionDate: 13/03/2008
T5 T7 = PMV40UN2: N-CHANNEL MOSFET WITH DIODE; Part Description: 30V, 4.4A, N-Channel Trench MOSFET; Manufacturer: NEXPERIA; PressFit: No; Bonding: No; Part Number: PMV40UN2; Component Kind: Standard; Component Type: Standard; Device: PMV40UN2; PackageDescription: SOT23, 0.95mm Pitch; 3 Pin, 1.30mm W X 2.90mm L X 1.10mm H body, IPC Medium Density; Manufacturer Part Number: PMV40UN2; Pin Count: 3; Case: SOT23-3; Mounted: Yes; Socket: No; SMD: Yes; Sense: No; ComponentHeight: 1.1mm; HelpURL: \\cern.ch\dfs\Applications\Altium\Datasheets\PMV40UN2.pdf; Author: CERN DEM BC; CreateDate: 23.04.2020; LatestRevisionDate: 23.04.2020
TR2 = XFMR_MINI-CIRCUITS_TCM2-1T: 50 Ohms 3 to 300MHz RF Transformer; Power: 0.25W; Part Number: XFMR_MINI-CIRCUITS_TCM2-1T; Component Kind: Standard; Component Type: Standard; Pin Count: 6; Value: 1:2; Status: None; Part Description: 50 Ohms 3 to 300MHz RF Transformer; Manufacturer: MINI-CIRCUITS; Manufacturer Part Number: TCM2-1T; Mounted: Yes; Socket: No; Sense: No; SMD: Yes; ComponentHeight: 4.06mm; HelpURL: \\cern.ch\dfs\Applications\Altium\Datasheets\XFMR_MINI-CIRCUITS_TCM2-1T.pdf; Author: CERN DEM HF; CreateDate: 30.05.2023; LatestRevisionDate: 30.05.2023

## Sheet Power_Supplies.SchDoc: Power supply
size 420 x 297 mm; EDA_Number: ARTIQ; Projet: ARTIQ/Sinara; Author: G.Kasprowicz; CompanyName: WUT ISE; DrawnBy: G.Kasprowicz; Organization: WUT ISE; Address1: PW ISE; Address2: Nowowiejska 15/19 00-665 Warsaw; Address3: gkasprow@gmail.com; Revision: 2; SheetNumber: -; SheetTotal: -; ModifiedBy: -; CheckedDate: -; Title2: Thermometers; DivGrp: WUT ISE; Designer: G.Kasprowicz; ModifiedDate: -; ProjectName: Sensor Box
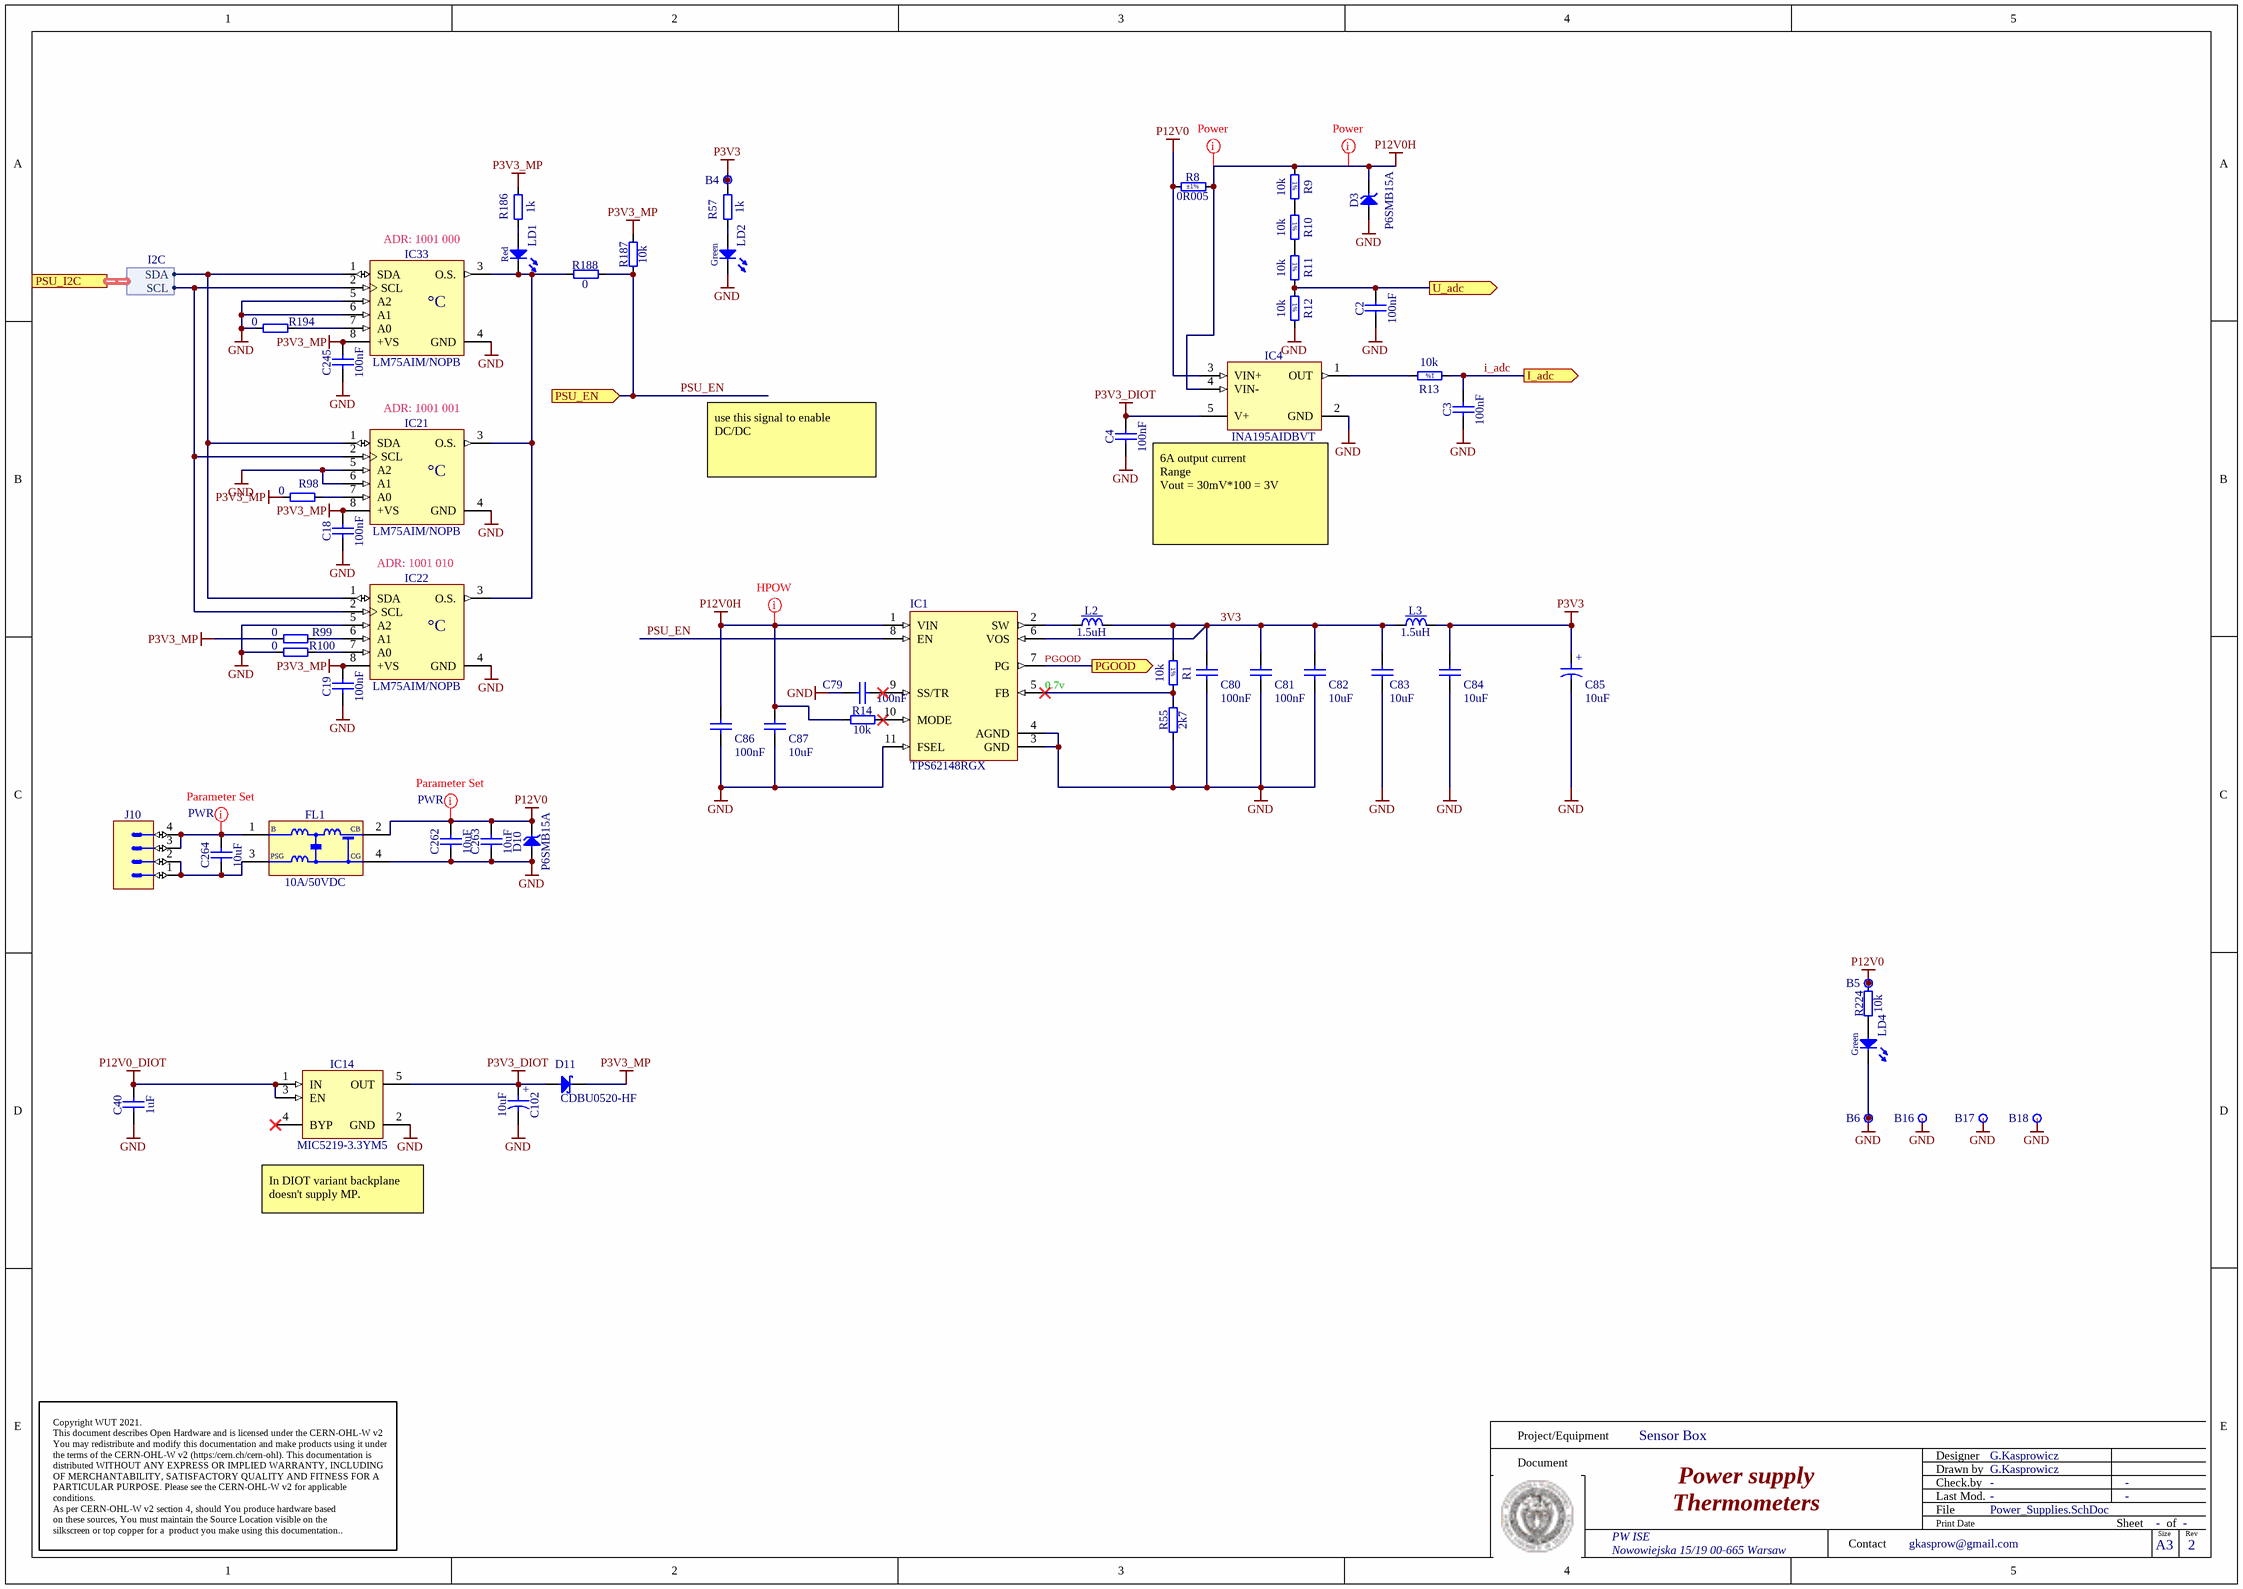
[diagram p1: Power_Supplies.SchDoc]

### Parts
B4  Plated Hole  [c150h50]  (value not drawn)  (no BOM)
B5  Plated Hole  [c150h50]  (value not drawn)  (no BOM)
B6  Plated Hole  [c150h50]  (value not drawn)  (no BOM)
B16  Plated Hole  [c150h50]  (value not drawn)  (no BOM)
B17  Plated Hole  [c150h50]  (value not drawn)  (no BOM)
B18  Plated Hole  [c150h50]  (value not drawn)  (no BOM)
C2  100nF  [CAPC1005X55N]
C3  100nF  [CAPC1005X55N]
C4  100nF  [CAPC1005X55N]
C18  100nF  [CAPC1005X55N]
C19  100nF  [CAPC1005X55N]
C40  1uF  [CAPC1608X87N]
C79  100nF  [CAPC1005X55N]
C80  100nF  [CAPC1005X55N]
C81  100nF  [CAPC1005X55N]
C82  10uF  [CAPC2012X95N]
C83  10uF  [CAPC2012X95N]
C84  10uF  [CAPC2012X95N]
C85  10uF  [CAPMP3216X180N]
C86  100nF  [CAPC1005X55N]
C87  10uF  [CAPC2012X95N]
C102  10uF  [CAPMP3216X180N]
C245  100nF  [CAPC1005X55N]
C262  10uF  [CAPC2012X95N]
C263  10uF  [CAPC2012X95N]
C264  10uF  [CAPC2012X95N]
D3  P6SMB15A  [DIOM5436X261N]
D10  P6SMB15A  [DIOM5436X261N]
D11  CDBU0520-HF  [SOD-523F]
FL1  10A/50VDC  [FIL_MURATA_BNX02]
IC1  TPS62148RGX  [TEXAS_RGX0011A]
IC4  INA195AIDBVT  [SOT95P280X145-5N]
IC14  MIC5219-3.3YM5  [SOT95P280X145-5N]
IC21  LM75AIM/NOPB  [SOIC127P600X175-8N]
IC22  LM75AIM/NOPB  [SOIC127P600X175-8N]
IC33  LM75AIM/NOPB  [SOIC127P600X175-8N]
J10  Mini-Fit Jr.™  [MOLEX_39-30-0040]  (value not drawn)
L2  1.5uH  [IND_WURTH_WE-LHMI_7050]
L3  1.5uH  [IND_WURTH_WE-LHMI_7050]
LD1  Red  [LED_AVAGO_HSMC-C120]
LD2  Green  [LED_AVAGO_HSME-C120]
LD4  Green  [LED_AVAGO_HSME-C120]
R1  10k  [RESC1005X40N]
R8  0R005  Tolerance: ±1%  [RES_SEI-CSNL2010_0R0031-0R1]
R9  10k  [RESC1005X40N]
R10  10k  [RESC1005X40N]
R11  10k  [RESC1005X40N]
R12  10k  [RESC1005X40N]
R13  10k  [RESC1005X40N]
R14  10k  [RESC1005X40N]
R55  2k7  [RESC1608X55N]
R57  1k  [RESC1608X55N]
R98  0  [RESC1005X40N]
R99  0  [RESC1005X40N]
R100  0  [RESC1005X40N]
R186  1k  [RESC1608X55N]
R187  10k  [RESC1005X40N]
R188  0  [RESC1005X40N]
R194  0  [RESC1005X40N]
R224  10k  [RESC1005X40N]

### Ports
I_adc (out), PGOOD (out), PSU_EN (in), PSU_I2C (harness I2C), U_adc (out)

### Harnesses
I2C: SDA, SCL

### Nets
GND: B6.1 B16.1 B17.1 B18.1 C2.1 C3.1 C4.1 C18.1 C19.1 C40.1 C79.1 C80.1 C81.1 C82.1 C83.1 C84.1 C85.2 C86.1 C87.1 C102.2 C245.1 C262.1 C263.1 D3.2(A) D10.2(A) FL1.4(CG) IC1.3(GND) IC1.4(AGND) IC1.11(FSEL) IC4.2(GND) IC14.2(GND) IC21.4(GND) IC21.5(A2) IC21.6(A1) IC22.4(GND) IC22.5(A2) IC33.4(GND) IC33.5(A2) IC33.6(A1) LD2.1(C) LD4.1(C) R12.2 R55.1 R100.1 R194.1
P3V3: B4.1 C84.2 C85.1 L3.2 R57.2
P3V3_DIOT: C4.2 C102.1 D11.2(A) IC4.5(V+) IC14.5(OUT)
P3V3_MP: C18.2 C19.2 C245.2 D11.1(C) IC21.8(+VS) IC22.8(+VS) IC33.8(+VS) R98.1 R99.1 R186.2 R187.2
P12V0: B5.1 C262.2 C263.2 D10.1(C) FL1.2(CB) IC4.3(VIN+) R8.1 R224.2
P12V0_DIOT: C40.2 IC14.1(IN) IC14.3(EN)
P12V0H: C86.2 C87.2 D3.1(C) IC1.1(VIN) IC4.4(VIN-) R8.2 R9.1 R14.1
3V3: C80.2 C81.2 C82.2 C83.2 IC1.6(VOS) L2.2 L3.1 R1.1
i_adc: C3.2 R13.1 ; port I_adc
PGOOD: IC1.7(PG) ; port PGOOD
PSU_EN: IC1.8(EN) R187.1 R188.2 ; port PSU_EN
NetC2_2: C2.2 R11.2 R12.1 ; port U_adc
NetC79_2: C79.2 IC1.9(SS/TR)
NetC264_1: C264.1 FL1.3(PSG) J10.1 J10.2
NetC264_2: C264.2 FL1.1(B) J10.3 J10.4
NetIC1_2: IC1.2(SW) L2.1
NetIC1_5: IC1.5(FB) R1.2 R55.2
NetIC1_10: IC1.10(MODE) R14.2
NetIC4_1: IC4.1(OUT) R13.2
NetIC9_4: IC21.1(SDA) IC22.1(SDA) IC33.1(SDA) ; port PSU_I2C.SDA
NetIC9_5: IC21.2(SCL) IC22.2(SCL) IC33.2(SCL) ; port PSU_I2C.SCL
NetIC21_3: IC21.3(O.S.) IC22.3(O.S.) IC33.3(O.S.) LD1.1(C) R188.1
NetIC21_7: IC21.7(A0) R98.2
NetIC22_6: IC22.6(A1) R99.2
NetIC22_7: IC22.7(A0) R100.2
NetIC33_7: IC33.7(A0) R194.2
NetLD1_2: LD1.2(A) R186.1
NetLD2_2: LD2.2(A) R57.1
NetLD4_2: LD4.2(A) R224.1
NetR9_2: R9.2 R10.1
NetR10_2: R10.2 R11.1

Not connected (* = marked no-connect by the designer): IC14 4(BYP)*

### Layout directives
net class PWR: NetC264_2, P12V0
net class HPOW: P12V0H
net class Power: P12V0H

### Notes on the sheet
- (near IC33) ADR: 1001 000
- (near IC21) ADR: 1001 001
- use this signal to enable DC/DC
- ADR: 1001 010
- 6A output current
  Range
  Vout = 30mV*100 = 3V
- (near IC1) 0.7v
- (near IC14) In DIOT variant backplane doesn't supply MP.
- Project/Equipment
- Document
- Designer
- Drawn by
- Check.by
- Contact
- File
- Last Mod.
- Print Date
- Sheet
- Size
- A3
- of
- Rev
- Copyright WUT 2021.
  This document describes Open Hardware and is licensed under the CERN-OHL-W v2
  You may redistribute and modify this documentation and make products using it under the terms of the CERN-OHL-W v2 (https:/cern.ch/cern-ohl). This documentation is distributed WITHOUT ANY EXPRESS OR IMPLIED WARRANTY, INCLUDING OF MERCHANTABILITY, SATISFACTORY QUALITY AND FITNESS FOR A PARTICULAR PURPOSE. Please see the CERN-OHL-W v2 for applicable conditions.
  As per CERN-OHL-W v2 section 4, should You produce hardware based
  on these sources, You must maintain the Source Location visible on the
  silkscreen or top copper for a  product you make using this documentation..
- (in symbol CTE3216-18_10UF_16V_20%_AVX_TCJ) +
- (in symbol LM75AIM/NOPB) °C
- (in symbol R0402_10K_1%_0.0625W_100PPM) 1%

### Library data of the parts
B4-B6 B16-B18 = PLATED_HOLE0.5_PAD1.5: Single Terminal Socket; Part Description: Plated Through Hole: Hole Dia.=0.5mm Pad Dia.=1.5mm; Mounted: No; Part Number: PLATED_HOLE0.5_PAD1.5; Component Type: Standard (No BOM); Pin Count: 1; Family: Plated Hole; Socket: No; SMD: No; Sense: No; Status: None; ComponentHeight: 0mm; HelpURL: Undefined; Author: CERN DEM MR; CreateDate: 12.10.2017; LatestRevisionDate: 12.10.2017; PackageDescription: Plated Through Hole: Hole Dia.=0.5mm Pad Dia.=1.5mm
C2-C4 C18 C19 C79-C81 C86 C245 = CC0402_100NF_50V_10%_X7R: as C5 on sheet DIOT_tester; Part Number: CC0402_100NF_50V_10%_X7R; Component Kind: Standard; Component Type: Standard; Pin Count: 2; Value: 100nF; Status: None; Manufacturer Part Number: CC0402_100NF_50V_10%_X7R; Case: 0402; Mounted: Yes; Socket: No; SMD: Yes; Sense: No; Manufacturer1 Example: MURATA; Manufacturer1 ComponentHeight: 0.55mm; HelpURL: \\cern.ch\dfs\Applications\Altium\Datasheets\CC0402_MURATA_GRM155R71H104KE14D.pdf; Author: CERN DEM MR; CreateDate: 30.06.2017; LatestRevisionDate: 30.06.2017
C40 = CC0603_1UF_25V_10%_X7R: as C20 on sheet DIOT_tester; Part Number: CC0603_1UF_25V_10%_X7R; Component Kind: Standard; Component Type: Standard; Pin Count: 2; Value: 1uF; Status: None; Manufacturer Part Number: CC0603_1UF_25V_10%_X7R; Case: 0603; Mounted: Yes; Socket: No; SMD: Yes; Sense: No; Manufacturer1 Example: MURATA; Manufacturer1 ComponentHeight: 0.9mm; HelpURL: \\cern.ch\dfs\Applications\Altium\Datasheets\CC0603_X7R_MURATA.pdf; Author: CERN DEM JLC; CreateDate: 18.01.2011; LatestRevisionDate: 18.01.2011
C82-C84 C87 C262-C264 = CC0805_10UF_25V_10%_X5R: as C36 on sheet DIOT_tester; Part Number: CC0805_10UF_25V_10%_X5R; Component Kind: Standard; Component Type: Standard; Pin Count: 2; Value: 10uF; Status: Preferred; Manufacturer Part Number: CC0805_10UF_25V_10%_X5R; Case: 0805; Mounted: Yes; Socket: No; SMD: Yes; Sense: No; Manufacturer1 Example: MURATA; Manufacturer1 ComponentHeight: 0.95mm; HelpURL: \\cern.ch\dfs\Applications\Altium\Datasheets\CC0805_X5R_MURATA_GRM.pdf; Author: CERN DEM JLC; CreateDate: 25.10.2012; LatestRevisionDate: 06.09.2016
C85 C102 = CTE3216-18_10UF_16V_20%_AVX_TCJ: Polarised capacitor; Part Description: ESR 0R200 Tantalum Solid Electrolytic Chip Capacitor with Conductive Polymer Electrode; Manufacturer: AVX; Manufacturer Part Number: TCJA106M016R0200; Voltage: 16V; Tolerance: ±20%; Part Number: CTE3216-18_10UF_16V_20%_AVX_TCJ; Component Kind: Standard; Component Type: Standard; Pin Count: 2; Value: 10uF; Status: Preferred; Case: A; Mounted: Yes; Socket: No; SMD: Yes; Sense: No; ComponentHeight: 1.8mm; HelpURL: \\cern.ch\dfs\Applications\Altium\Datasheets\CTE_AVX_TCJ.pdf; Author: CERN DEM JLC; CreateDate: 29.03.2012; LatestRevisionDate: 29.03.2012
D3 D10 = P6SMB15A: Transient Voltage Suppressor Diode (Uni-Directional); Part Description: Uni-directional Transient Voltage Suppressor (TVS) Diode; Manufacturer: LITTELFUSE; Voltage: 15V; Power: 600W; PressFit: No; Bonding: No; Part Number: P6SMB15A; Component Kind: Standard; Component Type: Standard; Device: P6SMB15A; PackageDescription: DO-214-AA/SMB Diode, Molded Body; 5.40mm L X 3.62mm W X 2.61mm H, IPC Medium Density; Manufacturer Part Number: P6SMB15A; Pin Count: 2; Case: SMB; Mounted: Yes; Socket: No; SMD: Yes; Sense: No; ComponentHeight: 2.61mm; HelpURL: \\cern.ch\dfs\Applications\Altium\Datasheets\P6SMB15A.pdf; Author: CERN DEM JLC; CreateDate: 12.07.2017; LatestRevisionDate: 12.07.2017
D11 = CDBU0520-HF: Schottky Diode; Manufacturer: COMCHIP; Part Description: 20V Surface mount Schottky Barrier Diode; Voltage: 20V; Power: 500mA; PressFit: No; Bonding: No; Manufacturer Part Number: CDBU0520-HF; PackageDescription: Small Outline Diode Flat Lead (SOD-523F), Body; 1.80mm L X 1mm W X 0.85mm H; Part Number: CDBU0520-HF; Component Kind: Standard; Component Type: Standard; Device: CDBU0520-HF; Pin Count: 2; Case: SOD-523F; Mounted: Yes; Socket: No; SMD: Yes; Sense: No; ComponentHeight: 1mm; HelpURL: \\cern.ch\dfs\Applications\Altium\Datasheets\CDBU0520-HF.pdf; Author: CERN DEM HF; CreateDate: 13.10.2023; LatestRevisionDate: 13.10.2023
FL1 = FIL_MURATA_BNX022-01L: Block Type EMIFIL (LC Combined); Part Description: Block Type EMIFIL (LC Combined) SMD Type, BNX02* Series; Manufacturer: MURATA; Resistance: 0.5R; Part Number: FIL_MURATA_BNX022-01L; Component Kind: Standard; Component Type: Standard; Pin Count: 2; Value: 10A/50VDC; Status: None; Manufacturer Part Number: BNX022-01L; Mounted: Yes; Socket: No; SMD: Yes; Sense: No; ComponentHeight: 3.3mm; HelpURL: \\cern.ch\dfs\Applications\Altium\Datasheets\FIL_MURATA_BNX022-01L.pdf; Author: CERN DEM JLC; CreateDate: 10.10.2012; LatestRevisionDate: 10.10.2012
IC1 = TPS62148RGX: 3V-17V 2A Step-Down Converter, High Accuracy, With DCS-Control; Manufacturer: TEXAS INSTRUMENTS; PressFit: No; Bonding: No; Part Number: TPS62148RGX; Component Kind: Standard; Component Type: Standard; Device: TPS62148RGX; PackageDescription: TEXAS Case Style (R-VQFN-HR-N11), 0.50mm Pitch, 11 Pin, 2.00mm W X 3.00mm L X 1.00mm H body; Part Description: 3V-17V 2A Step-Down Converter, High Accuracy, with DCS-Control; Manufacturer Part Number: TPS62148RGX; Pin Count: 11; Case: QFN14; Mounted: Yes; Socket: No; SMD: Yes; Sense: No; ComponentHeight: 1mm; HelpURL: \\cern.ch\dfs\Applications\Altium\Datasheets\TPS62148RGX.pdf; Author: CERN DEM MR; CreateDate: 08.02.2019; LatestRevisionDate: 08.02.2019
IC4 = ADC_INA195AIDBVT: Current Shunt Monitor -16V to +80V Common-Mode Range; Manufacturer: TEXAS INSTRUMENTS; PressFit: No; Bonding: No; Part Number: INA195AIDBVT; Component Kind: Standard; Component Type: Standard; Device: INA195AIDBVT; PackageDescription: SOT, 0.95mm pitch; 5 pin, 1.60mm W X 2.90mm L X 1.45mm H body, IPC Medium Density; Part Description: Current Shunt Monitor -16V to +80V Common-Mode Range; Manufacturer Part Number: INA195AIDBVT; Pin Count: 5; Case: SOT23-5; Mounted: Yes; Socket: No; SMD: Yes; Sense: No; ComponentHeight: 1.45mm; Author: GK; HelpURL: \\cern.ch\dfs\Applications\Altium\Datasheets\INA194AIDBVT.pdf; CreateDate: 10.05.2010; LatestRevisionDate: 10.05.2010
IC14 = MIC5219-3.3YM5: 500mA Peak Output LDO Regulator; Part Description: 3.3V 500mA Peak Output Low Drop-Out  (LDO) Regulator; Manufacturer: MICROCHIP TECHNOLOGY; PressFit: No; Bonding: No; Part Number: MIC5219-3.3YM5; Component Kind: Standard; Component Type: Standard; Device: MIC5219-3.3YM5; PackageDescription: SOT, 0.95mm pitch; 5 pin, 1.60mm W X 2.90mm L X 1.45mm H body, IPC Medium Density; Manufacturer Part Number: MIC5219-3.3YM5; Pin Count: 5; Case: SOT23-5; Mounted: Yes; Socket: No; SMD: Yes; Sense: No; ComponentHeight: 1.45mm; HelpURL: \\cern.ch\dfs\Applications\Altium\Datasheets\MIC5219-3.3YM5.pdf; Author: CERN DEM WB; CreateDate: 2019-04-16; LatestRevisionDate: 2019-04-16
IC21 IC22 IC33 = LM75AIM/NOPB: Digital Temperature Sensor and Thermal Watchdog with Two-Wire Interface; Part Description: -25° to +100°C ±2°C Digital Temperature Sensor and Thermal Watchdog with Two-Wire Interface; Manufacturer: TEXAS INSTRUMENTS; PressFit: No; Bonding: No; Part Number: LM75AIM/NOPB; Component Kind: Standard; Component Type: Standard; Device: LM75AIM/NOPB; PackageDescription: SOIC 8, Pitch 1.27mm - Body 4x5mm, IPC Medium Density; Manufacturer Part Number: LM75AIM; Pin Count: 8; Case: SOIC8; Mounted: Yes; Socket: No; SMD: Yes; Sense: No; ComponentHeight: 1.75mm; HelpURL: \\cern.ch\dfs\Applications\Altium\Datasheets\LM75AIM-NOPB.pdf; Author: CERN DEM JLC; CreateDate: 15.10.2012; LatestRevisionDate: 01.06.2022
J10 = MOLEX_39-30-0040: Connector 4 Male; Part Description: 4.20mm (.165") Pitch Mini-Fit Jr. Header, Dual Row, Right Angle with Snap-in Plastic Peg PCB Lock, 4 Circuits; Manufacturer: MOLEX; PressFit: No; Part Number: MOLEX_39-30-0040; Component Kind: Standard; Component Type: Standard; Pin Count: 4; Family: Mini-Fit Jr.™; Mounted: Yes; Socket: No; SMD: No; Sense: No; Status: None; Manufacturer Part Number: 39-30-0040; ComponentHeight: 11.4mm; HelpURL: \\cern.ch\dfs\Applications\Altium\Datasheets\MOLEX_39-30-0040.pdf; Author: CERN DEM JLC; CreateDate: 2018-10-02; LatestRevisionDate: 2018-10-02
L2 L3 = IND_1.5UH_20%_WURTH_WE-LHMI_74437349015: Inductor With Core; Part Description: SMD Power Inductor (WE-LHMI Series); Manufacturer: WURTH ELEKTRONIK; Power: 8A; Resistance: 0.0086R; Tolerance: ±20%; Part Number: IND_1.5UH_20%_WURTH_WE-LHMI_74437349015; Component Kind: Standard; Component Type: Standard; Pin Count: 2; Value: 1.5uH; Manufacturer Part Number: 74437349015; Mounted: Yes; Socket: No; SMD: Yes; Sense: No; ComponentHeight: 5mm; HelpURL: \\cern.ch\dfs\Applications\Altium\Datasheets\IND_WURTH_WE-LHMI_74437349015.pdf; Author: CERN DEM MR; CreateDate: 27.05.2016; LatestRevisionDate: 27.05.2016
LD1 = LED_AVAGO_HSMC-C120: LED Red 1C 2A; Part Description: High Performance Right Angle Chip Red LED; Manufacturer: AVAGO TECHNOLOGIES; PressFit: No; Bonding: No; Part Number: LED_AVAGO_HSMC-C120; Component Kind: Standard; Component Type: Standard; Color: Red; PackageDescription: Red Chip LED, 2-Leads, Body 1.7x1.1mm, Side Emitting Package; Status: Not Recommended; Manufacturer Part Number: HSMC-C120; Pin Count: 2; Mounted: Yes; Socket: No; SMD: Yes; Sense: No; ComponentHeight: 0.7mm; HelpURL: \\cern.ch\dfs\Applications\Altium\Datasheets\LED_AVAGO_HSMC-C120.pdf; ComponentLink1URL: \\cern.ch\dfs\Applications\Altium\Datasheets\LED_AVAGO_HSMC-C120_DESIGN-GUIDE.pdf; ComponentLink1Description: Design Guide; Author: CERN DEM JMW; CreateDate: 22.07.2009; LatestRevisionDate: 20.06.2012
LD2 LD4 = LED_AVAGO_HSME-C120: LED Green 1C 2A; Part Description: High Performance Right Angle Chip Green LED; Manufacturer: AVAGO TECHNOLOGIES; PressFit: No; Bonding: No; Part Number: LED_AVAGO_HSME-C120; Component Kind: Standard; Component Type: Standard; Color: Green; PackageDescription: Green Chip LED, 2-Leads, Body 1.7x1.1mm, Side Emitting Package; Status: Not Recommended; Manufacturer Part Number: HSME-C120; Pin Count: 2; Mounted: Yes; Socket: No; SMD: Yes; Sense: No; ComponentHeight: 0.7mm; HelpURL: \\cern.ch\dfs\Applications\Altium\Datasheets\LED_AVAGO_HSME-C120.pdf; ComponentLink1URL: \\cern.ch\dfs\Applications\Altium\Datasheets\LED_AVAGO_HSME-C110_DESIGN-GUIDE.pdf; ComponentLink1Description: Design Guide; Author: CERN DEM JMW; CreateDate: 22.07.2009; LatestRevisionDate: 20.06.2012
R1 R9-R14 R187 R224 = R0402_10K_1%_0.0625W_100PPM: as R15 on sheet DIOT_tester; Part Number: R0402_10K_1%_0.0625W_100PPM; Component Kind: Standard; Component Type: Standard; Pin Count: 2; Value: 10k; Status: Not Recommended; Power: 0.0625W; Tolerance: ±1%; Manufacturer Part Number: R0402_10K_1%_0.0625W_100PPM; Case: 0402; Mounted: Yes; Sense: No; Socket: No; SMD: Yes; Manufacturer1 Example: YAGEO PHYCOMP; Manufacturer1 ComponentHeight: 0.4mm; HelpURL: \\cern.ch\dfs\Applications\Altium\Datasheets\R0402_Phycomp_RC0402.pdf; Author: CERN DEM JLC
  R1 R9-R13: CreateDate: 03/12/2007; LatestRevisionDate: 17/10/2012
  R14 R187 R224: CreateDate: 03.12.2007; LatestRevisionDate: 17.10.2012
R8 = R2010_0R005_1%_1.5W_50PPM_SEI_CSNL: Resistor - 1%; Part Description: Power Thick Film Chip Resistor; Manufacturer: SEI (STACKPOLE ELECTRONICS INC.); Manufacturer Part Number: CSNL2010FT5L00; Power: 1.5W; TC: ±50ppm/°C; PressFit: No; Part Number: R2010_0R005_1%_1.5W_50PPM_SEI_CSNL; Component Kind: Standard; Component Type: Standard; Pin Count: 2; Value: 0R005; Status: None; Case: 2010; Mounted: Yes; Sense: No; Socket: No; SMD: Yes; ComponentHeight: 0.9mm; HelpURL: \\cern.ch\dfs\Applications\Altium\Datasheets\R2010_SEI_CSNL.pdf; Author: CERN DEM HF; CreateDate: 20.06.2024; LatestRevisionDate: 01.07.2024
R55 = R0603_2K7_1%_0.1W_100PPM: as R91 on sheet DIOT_tester; Part Number: R0603_2K7_1%_0.1W_100PPM; Component Kind: Standard; Component Type: Standard; Pin Count: 2; Value: 2k7; Status: Preferred; Tolerance: ±1%; Manufacturer Part Number: R0603_2K7_1%_0.1W_100PPM; Case: 0603; Mounted: Yes; Sense: No; Socket: No; SMD: Yes; Manufacturer1 Example: YAGEO PHYCOMP; Manufacturer1 ComponentHeight: 0.55mm; HelpURL: \\cern.ch\dfs\Applications\Altium\Datasheets\R0603_PHYCOMP_RC0603.pdf; Author: CERN DEM JLC; CreateDate: 02.05.2011; LatestRevisionDate: 02.05.2011
R57 R186 = R0603_1K_1%_0.1W_100PPM: as R62 on sheet DIOT_tester; Part Number: R0603_1K_1%_0.1W_100PPM; Component Kind: Standard; Component Type: Standard; Pin Count: 2; Value: 1k; Status: Preferred; Tolerance: ±1%; Manufacturer Part Number: R0603_1K_1%_0.1W_100PPM; Case: 0603; Mounted: Yes; Sense: No; Socket: No; SMD: Yes; Manufacturer1 Example: NIC COMPONENT; Manufacturer1 ComponentHeight: 0.55mm; HelpURL: \\cern.ch\dfs\Applications\Altium\Datasheets\R0603_NIC_NRC.pdf; Author: CERN DEM JLC; CreateDate: 03.12.2007; LatestRevisionDate: 13.03.2008
R98-R100 R188 R194 = R0402_0R_JUMPER: Resistor; Part Description: 1A (0.05R Max DC Resistance) Zero Ohm Jumper; Manufacturer: GENERIC; Manufacturer1 Part Number: 232270591001L; Part Number: R0402_0R_JUMPER; Component Kind: Standard; Component Type: Standard; Pin Count: 2; Value: 0; Status: Not recommended; Manufacturer Part Number: R0402_0R_JUMPER; Case: 0402; Mounted: Yes; Sense: No; Socket: No; SMD: Yes; Manufacturer1 Example: YAGEO PHYCOMP; Manufacturer1 ComponentHeight: 0.4mm; HelpURL: \\cern.ch\dfs\Applications\Altium\Datasheets\R0402_Phycomp_RC0402.pdf; Author: CERN DEM JLC; CreateDate: 03.12.2007; LatestRevisionDate: 17.10.2012